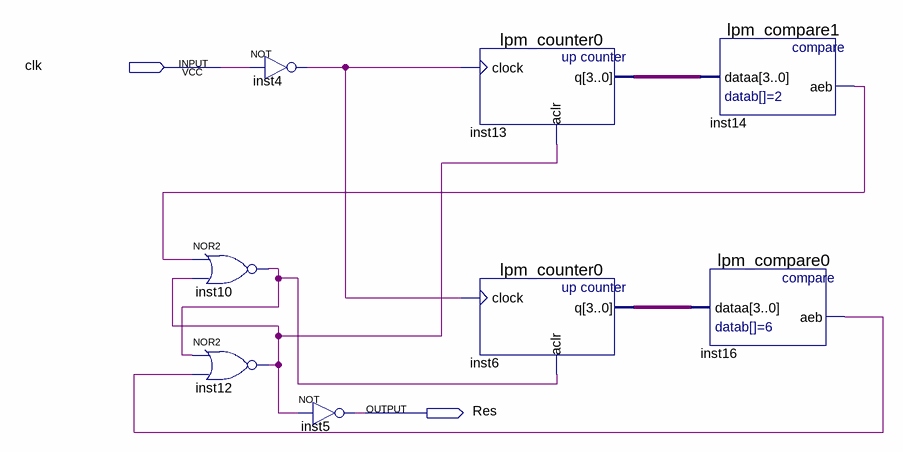
[diagram p0: schematic sheet]
// Quartus schematic Block2.bdf as structural Verilog: 8 symbols, 2 pins
module Block2 (
  input  clk,
  output Res
);

  wire inst4_out, inst10_out, inst12_out, inst14_aeb, inst16_aeb;
  wire [3:0] inst6_q, inst13_q;

  nor inst10 (inst10_out, inst14_aeb, inst12_out);
  nor inst12 (inst12_out, inst10_out, inst16_aeb);
  not inst4 (inst4_out, clk);
  not inst5 (Res, inst12_out);
  lpm_counter0 inst13 (.clock(inst4_out), .aclr(inst12_out), .q(inst13_q));
  lpm_counter0 inst6 (.clock(inst4_out), .aclr(inst10_out), .q(inst6_q));
  lpm_compare1 inst14 (.dataa(inst13_q), .aeb(inst14_aeb));
  lpm_compare0 inst16 (.dataa(inst6_q), .aeb(inst16_aeb));
endmodule
